# Altium schematic sheet FPGA_Misc.SchDoc
size B
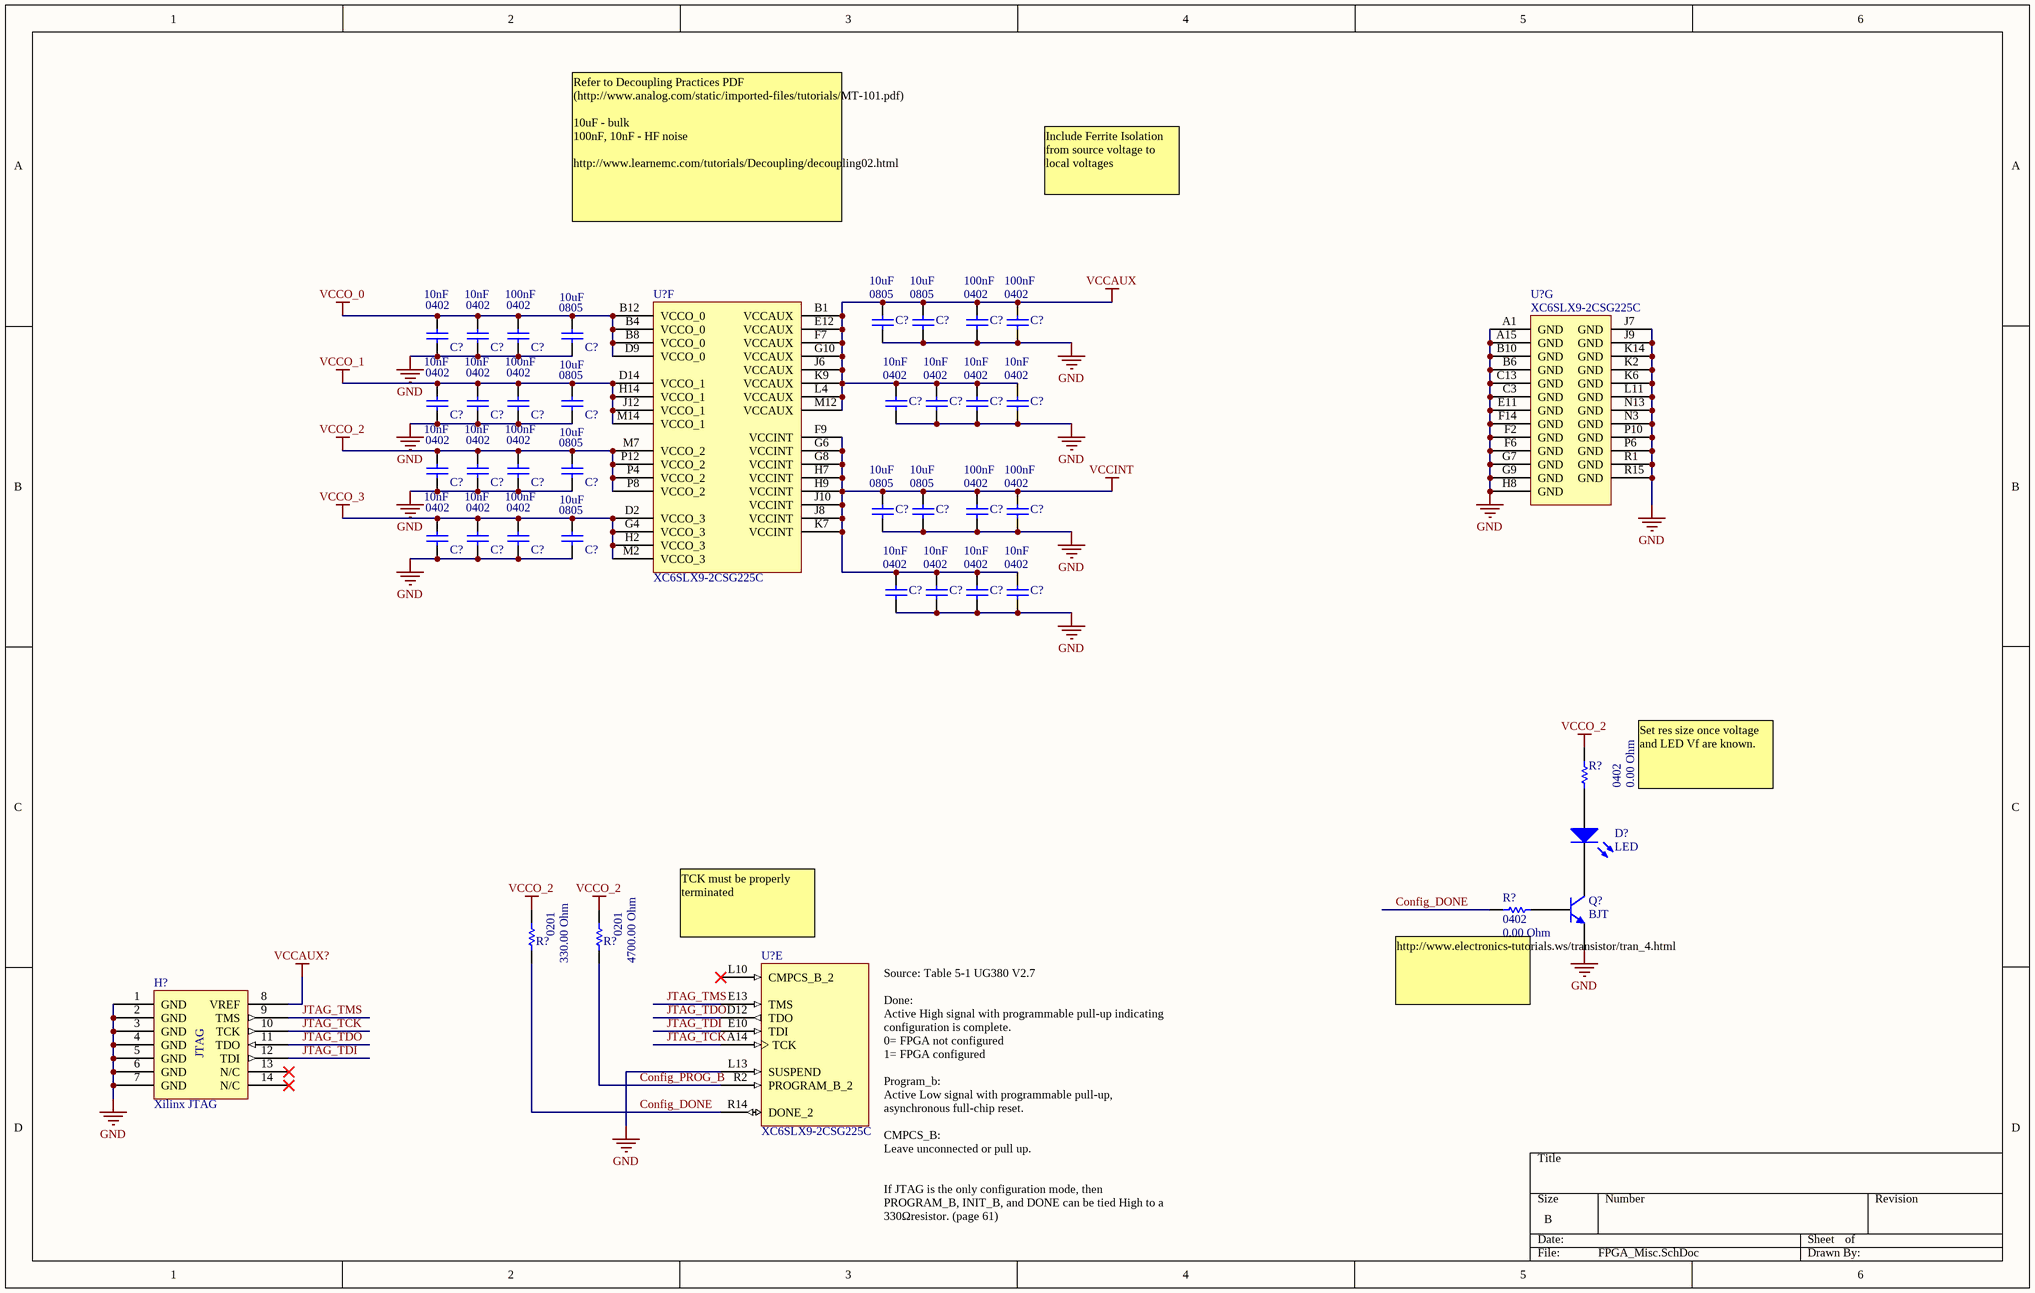
[diagram p0: FPGA_Misc.SchDoc]

## Parts
(Parts that share a designator on the sheet are numbered #1, #2 ... from top to bottom, then left to right.)
C?#1  value 10uF  Case-EIA: 0805  [CAPC0805(2012)145_L]  (hidden comment: CAP 10uF 6.3V 0805(2012))
C?#2  value 10uF  Case-EIA: 0805  [CAPC0805(2012)145_L]  (hidden comment: CAP 10uF 6.3V 0805(2012))
C?#3  value 100nF  Case-EIA: 0402  [CAPC0402(1005)60_M]  (hidden comment: CAP 100nF 10V 0402(1005))
C?#4  value 100nF  Case-EIA: 0402  [CAPC0402(1005)60_M]  (hidden comment: CAP 100nF 10V 0402(1005))
C?#5  value 10nF  Case-EIA: 0402  [CAPC0402(1005)60_M]  (hidden comment: CAP 10nF 10V 0402(1005))
C?#6  value 10nF  Case-EIA: 0402  [CAPC0402(1005)60_M]  (hidden comment: CAP 10nF 10V 0402(1005))
C?#7  value 100nF  Case-EIA: 0402  [CAPC0402(1005)60_M]  (hidden comment: CAP 100nF 10V 0402(1005))
C?#8  value 10uF  Case-EIA: 0805  [CAPC0805(2012)145_L]  (hidden comment: CAP 10uF 6.3V 0805(2012))
C?#9  value 10nF  Case-EIA: 0402  [CAPC0402(1005)60_M]  (hidden comment: CAP 10nF 10V 0402(1005))
C?#10  value 10nF  Case-EIA: 0402  [CAPC0402(1005)60_M]  (hidden comment: CAP 10nF 10V 0402(1005))
C?#11  value 100nF  Case-EIA: 0402  [CAPC0402(1005)60_M]  (hidden comment: CAP 100nF 10V 0402(1005))
C?#12  value 10uF  Case-EIA: 0805  [CAPC0805(2012)145_L]  (hidden comment: CAP 10uF 6.3V 0805(2012))
C?#13  value 10nF  Case-EIA: 0402  [CAPC0402(1005)60_M]  (hidden comment: CAP 10nF 10V 0402(1005))
C?#14  value 10nF  Case-EIA: 0402  [CAPC0402(1005)60_M]  (hidden comment: CAP 10nF 10V 0402(1005))
C?#15  value 10nF  Case-EIA: 0402  [CAPC0402(1005)60_M]  (hidden comment: CAP 10nF 10V 0402(1005))
C?#16  value 10nF  Case-EIA: 0402  [CAPC0402(1005)60_M]  (hidden comment: CAP 10nF 10V 0402(1005))
C?#17  value 10nF  Case-EIA: 0402  [CAPC0402(1005)60_M]  (hidden comment: CAP 10nF 10V 0402(1005))
C?#18  value 10nF  Case-EIA: 0402  [CAPC0402(1005)60_M]  (hidden comment: CAP 10nF 10V 0402(1005))
C?#19  value 100nF  Case-EIA: 0402  [CAPC0402(1005)60_M]  (hidden comment: CAP 100nF 10V 0402(1005))
C?#20  value 10uF  Case-EIA: 0805  [CAPC0805(2012)145_L]  (hidden comment: CAP 10uF 6.3V 0805(2012))
C?#21  value 10uF  Case-EIA: 0805  [CAPC0805(2012)145_L]  (hidden comment: CAP 10uF 6.3V 0805(2012))
C?#22  value 10uF  Case-EIA: 0805  [CAPC0805(2012)145_L]  (hidden comment: CAP 10uF 6.3V 0805(2012))
C?#23  value 100nF  Case-EIA: 0402  [CAPC0402(1005)60_M]  (hidden comment: CAP 100nF 10V 0402(1005))
C?#24  value 100nF  Case-EIA: 0402  [CAPC0402(1005)60_M]  (hidden comment: CAP 100nF 10V 0402(1005))
C?#25  value 10nF  Case-EIA: 0402  [CAPC0402(1005)60_M]  (hidden comment: CAP 10nF 10V 0402(1005))
C?#26  value 10nF  Case-EIA: 0402  [CAPC0402(1005)60_M]  (hidden comment: CAP 10nF 10V 0402(1005))
C?#27  value 100nF  Case-EIA: 0402  [CAPC0402(1005)60_M]  (hidden comment: CAP 100nF 10V 0402(1005))
C?#28  value 10uF  Case-EIA: 0805  [CAPC0805(2012)145_L]  (hidden comment: CAP 10uF 6.3V 0805(2012))
C?#29  value 10nF  Case-EIA: 0402  [CAPC0402(1005)60_M]  (hidden comment: CAP 10nF 10V 0402(1005))
C?#30  value 10nF  Case-EIA: 0402  [CAPC0402(1005)60_M]  (hidden comment: CAP 10nF 10V 0402(1005))
C?#31  value 10nF  Case-EIA: 0402  [CAPC0402(1005)60_M]  (hidden comment: CAP 10nF 10V 0402(1005))
C?#32  value 10nF  Case-EIA: 0402  [CAPC0402(1005)60_M]  (hidden comment: CAP 10nF 10V 0402(1005))
D?  LED
H?  Xilinx JTAG
Q?  BJT
R?#1  value 0.00 Ohm  Case-EIA: 0402  [RESC0402(1005)_N]  (hidden comment: Jumper 0402(1005))
R?#2  value 0.00 Ohm  Case-EIA: 0402  [RESC0402(1005)_N]  (hidden comment: Jumper 0402(1005))
R?#3  value 330.00 Ohm  Case-EIA: 0201  [RESC0201(0603)_M]  (hidden comment: 330R 1% 0201(0603))
R?#4  value 4700.00 Ohm  Case-EIA: 0201  [RESC0201(0603)_M]  (hidden comment: 4K7 1% 0201(0603))
U?#1  XC6SLX9-2CSG225C  [CSG225]  (part F of 7)
U?#2  XC6SLX9-2CSG225C  [CSG225]  (part G of 7)
U?#3  XC6SLX9-2CSG225C  [CSG225]  (part E of 7)

## Nets
GND: C?#1.1 C?#2.1 C?#3.1 C?#4.1 C?#5.1 C?#6.1 C?#7.1 C?#8.1 C?#9.1 C?#10.1 C?#11.1 C?#12.1 C?#13.1 C?#14.1 C?#15.1 C?#16.1 C?#17.1 C?#18.1 C?#19.1 C?#20.1 C?#21.1 C?#22.1 C?#23.1 C?#24.1 C?#25.1 C?#26.1 C?#27.1 C?#28.1 C?#29.1 C?#30.1 C?#31.1 C?#32.1 H?.1(GND) H?.2(GND) H?.3(GND) H?.4(GND) H?.5(GND) H?.6(GND) H?.7(GND) Q?.1(E) U?#2.A1(GND) U?#2.A15(GND) U?#2.B6(GND) U?#2.B10(GND) U?#2.C3(GND) U?#2.C13(GND) U?#2.E11(GND) U?#2.F2(GND) U?#2.F6(GND) U?#2.F14(GND) U?#2.G7(GND) U?#2.G9(GND) U?#2.H8(GND) U?#2.J7(GND) U?#2.J9(GND) U?#2.K2(GND) U?#2.K6(GND) U?#2.K14(GND) U?#2.L11(GND) U?#2.N3(GND) U?#2.N13(GND) U?#2.P6(GND) U?#2.P10(GND) U?#2.R1(GND) U?#2.R15(GND) U?#3.L13(SUSPEND)
VCCAUX: C?#1.2 C?#2.2 C?#3.2 C?#4.2 C?#13.2 C?#14.2 C?#15.2 C?#16.2 U?#1.B1(VCCAUX) U?#1.E12(VCCAUX) U?#1.F7(VCCAUX) U?#1.G10(VCCAUX) U?#1.J6(VCCAUX) U?#1.K9(VCCAUX) U?#1.L4(VCCAUX) U?#1.M12(VCCAUX)
VCCAUX?: H?.8(VREF)
VCCINT: C?#21.2 C?#22.2 C?#23.2 C?#24.2 C?#29.2 C?#30.2 C?#31.2 C?#32.2 U?#1.F9(VCCINT) U?#1.G6(VCCINT) U?#1.G8(VCCINT) U?#1.H7(VCCINT) U?#1.H9(VCCINT) U?#1.J8(VCCINT) U?#1.J10(VCCINT) U?#1.K7(VCCINT)
VCCO_0: C?#5.2 C?#6.2 C?#7.2 C?#8.2 U?#1.B4(VCCO_0) U?#1.B8(VCCO_0) U?#1.B12(VCCO_0) U?#1.D9(VCCO_0)
VCCO_1: C?#9.2 C?#10.2 C?#11.2 C?#12.2 U?#1.D14(VCCO_1) U?#1.H14(VCCO_1) U?#1.J12(VCCO_1) U?#1.M14(VCCO_1)
VCCO_2: C?#17.2 C?#18.2 C?#19.2 C?#20.2 R?#1.2 R?#3.2 R?#4.2 U?#1.M7(VCCO_2) U?#1.P4(VCCO_2) U?#1.P8(VCCO_2) U?#1.P12(VCCO_2)
VCCO_3: C?#25.2 C?#26.2 C?#27.2 C?#28.2 U?#1.D2(VCCO_3) U?#1.G4(VCCO_3) U?#1.H2(VCCO_3) U?#1.M2(VCCO_3)
Config_DONE: R?#2.2 R?#3.1 U?#3.R14(DONE_2)
Config_PROG_B: R?#4.1 U?#3.R2(PROGRAM_B_2)
JTAG_TCK: H?.10(TCK) U?#3.A14(TCK)
JTAG_TDI: H?.12(TDI) U?#3.E10(TDI)
JTAG_TDO: H?.11(TDO) U?#3.D12(TDO)
JTAG_TMS: H?.9(TMS) U?#3.E13(TMS)
NetD?_1: D?.1(A) R?#1.1
NetD?_2: D?.2(K) Q?.3(C)
NetQ?_2: Q?.2(B) R?#2.1

Not connected (* = marked no-connect by the designer): H? 13(N/C)* 14(N/C)*; U?#3 L10(CMPCS_B_2)*

## Notes on the sheet
- Refer to Decoupling Practices PDF (http://www.analog.com/static/imported-files/tutorials/MT-101.pdf)
  10uF - bulk
  100nF, 10nF - HF noise
  http://www.learnemc.com/tutorials/Decoupling/decoupling02.html
- Include Ferrite Isolation from source voltage to local voltages
- Set res size once voltage and LED Vf are known.
- (near U?#3) TCK must be properly terminated
- http://www.electronics-tutorials.ws/transistor/tran_4.html
- Source: Table 5-1 UG380 V2.7
  Done:
  Active High signal with programmable pull-up indicating configuration is complete.
  0= FPGA not configured
  1= FPGA configured
  Program_b:
  Active Low signal with programmable pull-up, asynchronous full-chip reset.
  CMPCS_B:
  Leave unconnected or pull up.
  If JTAG is the only configuration mode, then PROGRAM_B, INIT_B, and DONE can be tied High to a 330Ωresistor. (page 61)
- (in symbol Xilinx JTAG Header) JTAG

## Library data of the parts
C?#1 C?#2 C?#8 C?#12 C?#20-C?#22 C?#28 = CMP-1036-04915-1: CAP 10uF 6.3V ±10% 0805 (2012 Metric) Thickness 1.45mm SMD; Case-Metric: 2012; Technology: SMT; Tolerance: ±10%; Rated Voltage: 6.3 V; Max Thickness: 1.45 mm
C?#3 C?#4 C?#7 C?#11 C?#19 C?#23 C?#24 C?#27 = CMP-1034-02065-1: CAP 100nF 10V ±10% 0402 (1005 Metric) Thickness 0.6mm SMD; Case-Metric: 1005; Max Thickness: 0.6 mm; Tolerance: ±10%; Rated Voltage: 10 V; Technology: SMT
C?#5 C?#6 C?#9 C?#10 C?#13-C?#18 C?#25 C?#26 C?#29-C?#32 = CMP-1034-01871-1: CAP 10nF 10V ±10% 0402 (1005 Metric) Thickness 0.6mm SMD; Case-Metric: 1005; Rated Voltage: 10 V; Technology: SMT; Max Thickness: 0.6 mm; Tolerance: ±10%
D? = LED: SMT LED
H? = Xilinx JTAG Header
Q? = BJT: NPN General Purpose Amplifier
R?#1 R?#2 = CMP-1011-00001-1: Jumper 0402 (1005 Metric); Tolerance: None; Case-Metric: 1005; Power: None; Technology: SMT
R?#3 = CMP-1010-00360-1: 330R 0.05W 1% 0201 (0603 Metric)  SMD; Case-Metric: 0603; Power: 0.05 W; Tolerance: 1 %; Technology: SMT
R?#4 = CMP-1010-00492-1: 4K7 0.05W 1% 0201 (0603 Metric)  SMD; Case-Metric: 0603; Technology: SMT; Tolerance: 1 %; Power: 0.05 W
U?#1-U?#3 = XC6SLX9-2CSG225C: Spartan-6 LX 1.2V FPGA, 160 User I/Os, 225-Ball Chip-Scale BGA (0.8mm Pitch), Speed Grade 2, Commercial Grade, Pb-Free; DatasheetVersion: ver1.6, Nov-2010; PackageVersion: ver1.1, Nov-2009; PackageReference: CSG225; PackageDescription: 225-Ball Chip-Scale BGA (CSG225) Package, 0.8 mm Pitch; Code_JEDEC: MO-275-HHAC-1; ComponentLink1Description: Manufacturer URL; ComponentLink1URL: http://www.xilinx.com/; ComponentLink2Description: Spartan-6 Datasheet; ComponentLink2URL: http://www.xilinx.com/support/documentation/data_sheets/ds160.pdf; ComponentLink3Description: Spartan-6 Documents; ComponentLink3URL: http://www.xilinx.com/support/documentation/spartan-6.htm